# EasyEDA Pro project ProProject_AD9833.epro, board PCB1
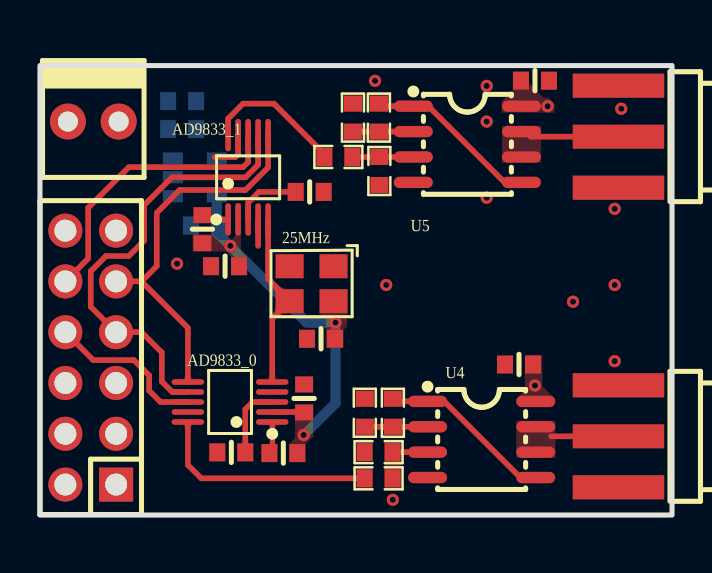
[diagram p4: board, top side]
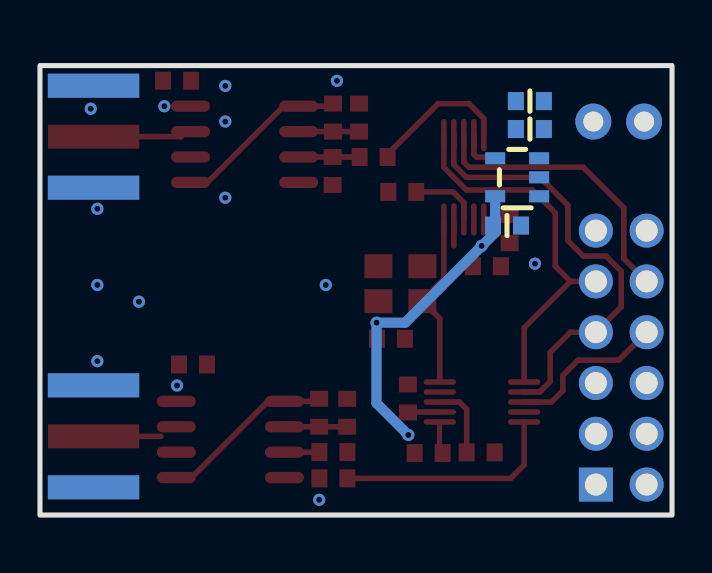
[diagram p5: board, bottom side, seen from below]

Outline 31.62 x 22.48 mm; copper layers: Top Layer, Bottom Layer. Coordinates in mm from the lower left corner of the outline.
Outline path: rectangle 0,22.48 31.62,0
Stack: Top Layer 0.035mm / Dielectric1 1.51mm FR4 er 4.5 / Bottom Layer 0.035mm

## Design rules (mm)
template: 自定义配置
spacing copperThickness1oz (default): track to track 0.102, other pairs 0.152 to 0.3
spacing copperThickness2oz: track to track 0.203, other pairs 0.152 to 0.3
track width copperThickness1oz (default): min 0.127, default 0.254, max 2.54
track width copperThickness2oz: min 0.203, default 0.254, max 2.54
differential pair differentialPair (default): width min 0.127, default 0.254, max 2.54; gap min 0.152, default 0.152
via viaSize (default): diameter min 0.5, default 0.61, max 10; hole min 0.3, default 0.305, max 6.299
net +5V uses copperRegion1

## Placement (name value [footprint] x y rotation side)
25MHz  25MHz  [OSC-SMD_4P-L3.2-W2.5-BL]  13.59 11.57 180 top
AD9833_0  AD9833WBRMZ-REEL  [MSOP-10_L3.0-W3.0-P0.50-LS5.0-BL]  9.51 5.65 90 top
AD9833_1  AD9833WBRMZ-REEL  [MSOP-10_L3.0-W3.0-P0.50-LS5.0-BL]  10.41 16.89 0 top
C1  10nF  [C0603]  12.18 3.1 180 top
C2  10nF  [C0603]  8.13 14.3 90 top
C3  10uF  [C0603]  7.11 20.7 180 bottom
C4  100nF  [C0603]  13.22 5.83 270 top
C5  100nF  [C0603]  9.26 12.45 0 top
C7  100nF  [C0603]  24.76 21.72 180 top
C8  100nF  [C0603]  14.06 8.82 0 top
C9  100nF  [C0603]  9.57 3.13 0 top
C10  100nF  [C0603]  13.49 16.16 180 top
C11  1uF  [C0603]  7.11 19.3 0 bottom
C12  1uF  [C0603]  8.25 14.48 0 bottom
C13  100nF  [C0603]  23.97 7.53 0 top
H3  PZ254V-12-12P  [HDR-TH_12P-P2.54-V-M-R2-C6-S2.54]  2.54 7.87 90 top
Power1  -  [KF2510_2P]  2.67 19.68 0 top
R1  1K  [R0603]  16.25 5.11 270 top
R2  10K  [R0603]  17.66 5.11 90 top
R3  1K  [R0603]  15.66 19.88 270 top
R4  10K  [R0603]  16.96 19.88 90 top
R5  100  [R0603]  16.94 3.14 0 top
R6  1K  [R0603]  16.98 17.21 90 top
R7  1K  [R0603]  14.93 17.91 0 top
R8  100  [R0603]  16.94 1.83 0 top
RF1  BWSMA-KE-P001  [SMA-SMD_BWSMA-KE-P001]  28.83 3.94 0 top
RF2  BWSMA-KE-P001  [SMA-SMD_BWSMA-KE-P001]  28.83 18.92 0 top
U4  OPA2350UA/2K5G4  [SOIC-8_L5.0-W4.0-P1.27-LS6.1-BL]  22.1 3.78 270 top
U5  OPA2350UA/2K5G4  [SOIC-8_L5.0-W4.0-P1.27-LS6.1-BL]  21.38 18.54 270 top
U6  TPLP5907MFX-3.3  [SOT-23-5_L2.9-W1.6-P0.95-LS2.8-BR]  7.75 16.89 180 bottom

## Footprints (pads in the part's own frame, mm; a bottom-side part is the same pattern mirrored in y, then rotated)
C0603
  rect 0.8x0.9 smd: 1(-0.7,0) 2(0.7,0)
HDR-TH_12P-P2.54-V-M-R2-C6-S2.54
  rect 1.7x1.7 hole 1.1: 1(-6.35,-1.27)
  round 1.7 hole 1.1: 2(-6.35,1.27) 3(-3.81,-1.27) 4(-3.81,1.27) 5(-1.27,-1.27) 6(-1.27,1.27) 7(1.27,-1.27) 8(1.27,1.27) 9(3.81,-1.27) 10(3.81,1.27) 11(6.35,-1.27) 12(6.35,1.27)
KF2510_2P
  rrect 1.8x1.8 hole 1: 1(-1.27,0) 2(1.27,0)
MSOP-10_L3.0-W3.0-P0.50-LS5.0-BL
  oval 0.28x1.62 smd: 1(-1,-2.11) 2(-0.5,-2.11) 3(0,-2.11) 4(0.5,-2.11) 5(1,-2.11) 6(1,2.11) 7(0.5,2.11) 8(0,2.11) 9(-0.5,2.11) 10(-1,2.11)
OSC-SMD_4P-L3.2-W2.5-BL
  rect 1.4x1.2 smd: 1(-1.1,-0.875) 2(1.1,-0.875) 3(1.1,0.875) 4(-1.1,0.875)
R0603
  rect 0.8x0.9 smd: 1(-0.7,0) 2(0.7,0)
SMA-SMD_BWSMA-KE-P001
  rect 4.572x1.2 smd: 1(0.115,-2.55) 2(0.115,2.55) 5(0.115,0)
  rect 4.572x1.2 smd far side: 3(0.115,2.55) 4(0.115,-2.55)
SOIC-8_L5.0-W4.0-P1.27-LS6.1-BL
  oval 0.569x1.95 smd: 1(-1.905,-2.705) 2(-0.635,-2.705) 3(0.635,-2.705) 4(1.905,-2.705) 5(1.905,2.705) 6(0.635,2.705) 7(-0.635,2.705) 8(-1.905,2.705)
SOT-23-5_L2.9-W1.6-P0.95-LS2.8-BR
  rect 1x0.6 smd: 1(1.1,-0.95) 2(1.1,0) 3(1.1,0.95) 4(-1.1,0.95) 5(-1.1,-0.95)

## Nets
+5V: C3.2 C7.2 C11.1 C13.2 Power1.2 U4.8 U5.8 U6.1 U6.3
GND: 25MHz.2 AD9833_0.4 AD9833_0.9 AD9833_1.4 AD9833_1.9 C3.1 C4.1 C5.1 C7.1 C8.1 C9.1 C10.1 C11.2 C12.1 C13.1 H3.3 H3.4 Power1.1 R1.1 R3.1 R5.1 R6.1 RF1.1 RF1.2 RF1.3 RF1.4 RF2.1 RF2.2 RF2.3 RF2.4 U4.4 U5.4 U6.2
VCC: 25MHz.4 AD9833_0.2 AD9833_1.2 C1.1 C2.1 C4.2 C5.2 C8.2 C12.2 U6.5
CAP0: AD9833_0.3 C9.2
CAP1: AD9833_1.3 C10.2
COMP0: AD9833_0.1 C1.2
COMP1: AD9833_1.1 C2.2
FYNC0: AD9833_0.8 H3.8
FYNC1: AD9833_1.8 H3.10
MCLK: 25MHz.3 AD9833_0.5 AD9833_1.5
SCK: AD9833_0.7 AD9833_1.7 H3.7
SDI: AD9833_0.6 AD9833_1.6 H3.9
SIG0: RF1.5 U4.6 U4.7
SIG1: RF2.5 U5.6 U5.7
VOUT0: AD9833_0.10 R8.1
VOUT1: AD9833_1.10 R7.1
$1N1362: R1.2 R2.1 U4.2
$1N1363: R2.2 U4.1 U4.5
$1N1364: R3.2 R4.1 U5.2
$1N1365: R4.2 U5.1 U5.5
$1N1366: R5.2 R8.2 U4.3
$1N1367: R6.2 R7.2 U5.3

Pads without a net: 25MHz 1; H3 1 2 5 6 11 12; U6 4

## Via types
v1: diameter 0.61, hole 0.305, Top Layer to Bottom Layer, 17 vias

## Routing (per net, layer and track width the routed paths; a pad name or vN(x,y) marks a point on that pad's centre or on a via; arc(x,y) is an arc through that point)
+5V:
  vias: v1(24.76,6.48) v1(25.4,20.45)
GND: length 3.5
  Top Layer w0.28: AD9833_1.9 9.91,18.04 9.77,17.9 8.74,17.9 ; AD9833_1.4 10.91,13.46
  vias: v1(6.86,12.57) v1(16.76,21.72) v1(17.32,11.51) v1(17.65,0.76) v1(22.35,19.68) v1(22.35,15.87) v1(22.35,21.46) v1(26.67,10.67) v1(28.75,15.32) v1(28.75,11.51) v1(28.75,7.7) v1(29.08,20.32)
VCC: length 17.5
  Top Layer w0.28: AD9833_0.2 13.15,5.15 13.2,5.1
  Bottom Layer w0.508: U6.5 8.85,14.12 13.35,9.62 v1(14.78,9.62) 14.78,5.59 v1(13.19,4)
  vias: v1(9.53,13.46)
CAP0: length 3.7
  Top Layer w0.28: AD9833_0.3 10.64,5.65 10.27,5.28 10.27,3.06
CAP1: length 3.6
  Top Layer w0.28: 12.95,16.16 10.95,16.16 10.41,15.62 AD9833_1.3
COMP0: length 1.6
  Top Layer w0.254: 11.63,3.1 11.63,4.64 AD9833_0.1
COMP1: length 1.4
  Top Layer w0.28: AD9833_1.1 8.34,14.78 C2.2
FYNC0: length 8
  Top Layer w0.28: H3.8 2.67,7.75 4.7,7.75 5.46,6.98 5.46,6.22 6.03,5.65 AD9833_0.8
FYNC1: length 14.5
  Top Layer w0.28: AD9833_1.8 10.41,17.66 10.16,17.4 4.44,17.4 2.41,15.37 2.41,12.83 H3.10
MCLK: length 8.9
  Top Layer w0.28: AD9833_0.5 11.62,9.83 25MHz.3 12.49,10.73 11.41,11.81 AD9833_1.5
SCK: length 22.4
  Top Layer w0.28: AD9833_1.7 10.91,17.52 10.29,16.89 6.6,16.89 5.21,15.49 5.21,13.72 4.44,12.95 3.3,12.95 2.54,12.19 2.54,10.41 H3.7 5.08,9.14 6.1,8.13 6.1,6.68 6.62,6.15 AD9833_0.7
SDI: length 19.1
  Top Layer w0.28: AD9833_1.6 11.41,17.38 10.29,16.26 6.99,16.26 5.84,15.11 5.84,12.45 5.08,11.68 ; 5.08,11.68 7.4,9.36 AD9833_0.6 ; 5.08,11.68 H3.9
SIG0: length 3.3
  Top Layer w0.28: 28.83,3.94 25.57,3.94
SIG1: length 4.3
  Top Layer w0.28: 28.83,18.92 24.56,18.92 24.55,18.94
VOUT0: length 11.3
  Top Layer w0.28: R8.1 8.07,1.83 7.4,2.51 AD9833_0.10
VOUT1: length 7.1
  Top Layer w0.28: AD9833_1.10 9.41,19.83 10.16,20.57 11.7,20.57 14.23,18.05 R7.1
$1N1362: length 3.1
  Top Layer w0.28: U4.2 R2.1 R1.2
$1N1363: length 8.7
  Top Layer w0.28: U4.5 24.77,1.91 24,1.91 20.22,5.69 17.69,5.69
$1N1364: length 3
  Top Layer w0.28: U5.2 R4.1 R3.2
$1N1365: length 8.8
  Top Layer w0.28: U5.5 23.24,16.64 19.43,20.45 U5.1 17.09,20.45 R4.2
$1N1366: length 1.8
  Top Layer w0.28: U4.3 R5.2
$1N1367: length 3
  Top Layer w0.28: R7.2 R6.2 U5.3

## Copper pours and planes (outline as drawn; the poured copper is in the pictures)
+5V on Top Layer: 23.82,8 25.78,8 25.78,5.4 23.82,5.4
+5V on Top Layer: 23.1,22.18 25.74,22.18 25.74,20.12 23.1,20.12
+5V on Bottom Layer: 2.92,20.57 5.37,20.57 5.97,21.17 6.99,21.17 6.99,18.9 7.6,18.29 7.75,18.29 7.75,15.37 6.27,15.37 5.99,15.64 5.99,16.26 7.24,16.26 7.37,16.38 7.37,17.27 5.84,18.8 3.18,18.8 2.92,19.05
VCC on Top Layer: 13.97,11.3 15.37,11.3 15.37,8.36 13.97,8.36
VCC on Top Layer: 12.47,5.53 13.68,5.53 13.68,2.64 12.47,2.64
VCC on Top Layer: 7.64,15.6 10.37,15.6 10.37,11.99 7.64,11.99
SIG0 on Top Layer: 23.83,4.71 25.8,4.71 25.8,2.85 23.83,2.85
SIG1 on Top Layer: 23.11,19.46 25.07,19.46 25.07,17.62 23.11,17.62
$1N1366 on Top Layer: 17.24,3.61 18.05,3.61 18.05,1.37 17.24,1.37

Small or netless copper shapes (teardrops, artwork), in the pictures only: 19 on Top Layer
